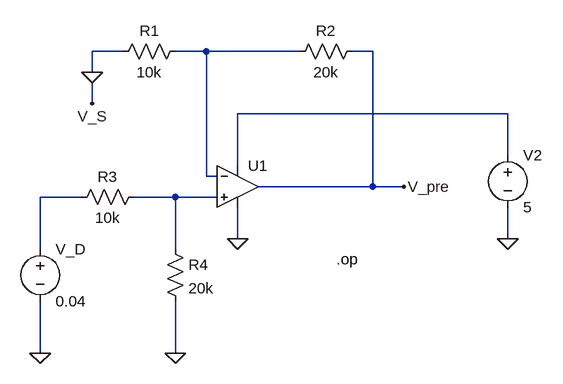
[diagram p0: schematic u1_vds_sensing.asc]
u1_vds_sensing.asc, the LTspice schematic file:
Version 4
SHEET 1 880 784
WIRE 160 176 112 176
WIRE 288 176 240 176
WIRE 432 176 288 176
WIRE 544 176 512 176
WIRE 112 208 112 176
WIRE 112 256 112 224
WIRE 752 272 336 272
WIRE 752 336 752 272
WIRE 336 352 336 272
WIRE 288 368 288 176
WIRE 304 368 288 368
WIRE 544 384 544 176
WIRE 544 384 368 384
WIRE 592 384 544 384
WIRE 96 400 32 400
WIRE 240 400 176 400
WIRE 304 400 240 400
WIRE 336 464 336 416
WIRE 752 464 752 416
WIRE 32 480 32 400
WIRE 240 480 240 400
WIRE 32 640 32 560
WIRE 240 640 240 560
FLAG 32 640 0
FLAG 240 640 0
FLAG 336 464 0
FLAG 112 208 0
FLAG 112 256 V_S
FLAG 592 384 V_pre
FLAG 752 464 0
SYMBOL OpAmps\\UniversalOpAmp2 336 384 R0
SYMATTR InstName U1
SYMBOL res 256 160 R90
WINDOW 0 0 56 VBottom 2
WINDOW 3 32 56 VTop 2
SYMATTR InstName R1
SYMATTR Value 10k
SYMBOL res 528 160 R90
WINDOW 0 0 56 VBottom 2
WINDOW 3 32 56 VTop 2
SYMATTR InstName R2
SYMATTR Value 20k
SYMBOL res 80 416 R270
WINDOW 0 32 56 VTop 2
WINDOW 3 0 56 VBottom 2
SYMATTR InstName R3
SYMATTR Value 10k
SYMBOL res 224 464 R0
SYMATTR InstName R4
SYMATTR Value 20k
SYMBOL voltage 32 464 R0
WINDOW 123 0 0 Left 0
WINDOW 39 0 0 Left 0
SYMATTR InstName V_D
SYMATTR Value 0.04
SYMBOL voltage 752 320 R0
WINDOW 123 0 0 Left 0
WINDOW 39 0 0 Left 0
SYMATTR InstName V2
SYMATTR Value 5
TEXT 488 496 Left 2 !.op

The netlist it stands for:
* u1_vds_sensing.asc
XU1 N004 N001 N002 0 V_pre level2 Avol=1Meg GBW=10Meg Slew=10Meg Ilimit=25m Rail=0 Vos=0 En=0 Enk=0 In=0 Ink=0 Rin=500Meg  ; pins In+ In- V+ V- OUT
R1 N001 0 10k
R2 V_pre N001 20k
R3 N003 N004 10k
R4 N004 0 20k
V_D N003 0 0.04
V2 N002 0 5
.op
.lib UniversalOpAmp2.lib
.backanno
.end